# Altium schematic sheet 220V Sense Input Socket.SchDoc: 220V Sense Input Connector
size 292 x 193 mm; SheetNumber: 2; SheetTotal: 11
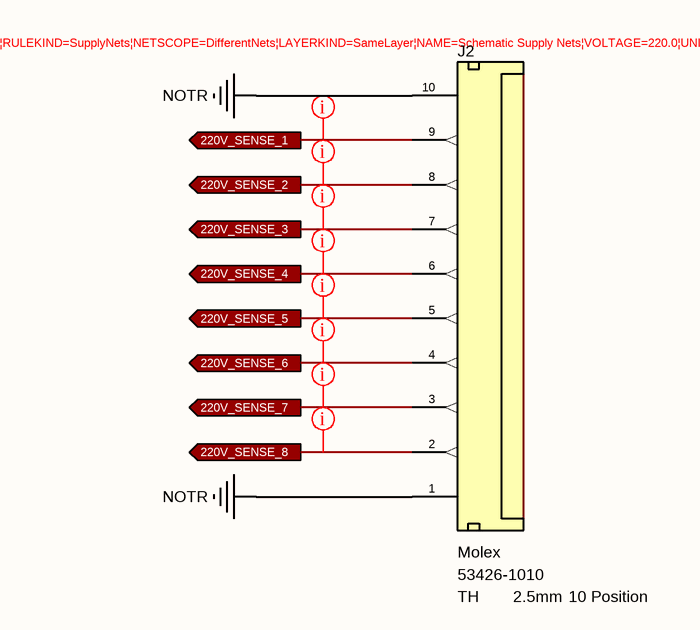
[diagram p0: 220V Sense Input Socket.SchDoc]

## Parts
J2  Manufacturer Name: Molex  Case: TH  Pitch: 2.5mm  Position: 10 Position  [Connector 10P (2.54)]  (hidden comment: 53426-1010)

## Ports
220V_SENSE_1 (out), 220V_SENSE_2 (out), 220V_SENSE_3 (out), 220V_SENSE_4 (out), 220V_SENSE_5 (out), 220V_SENSE_6 (out), 220V_SENSE_7 (out), 220V_SENSE_8 (out)

## Nets
NOTR: J2.1(Pin-1) J2.10(Pin-10)
220V_SENSE_1: J2.9(Pin-9) ; port 220V_SENSE_1
220V_SENSE_2: J2.8(Pin-8) ; port 220V_SENSE_2
220V_SENSE_3: J2.7(Pin-7) ; port 220V_SENSE_3
220V_SENSE_4: J2.6(Pin-6) ; port 220V_SENSE_4
220V_SENSE_5: J2.5(Pin-5) ; port 220V_SENSE_5
220V_SENSE_6: J2.4(Pin-4) ; port 220V_SENSE_6
220V_SENSE_7: J2.3(Pin-3) ; port 220V_SENSE_7
220V_SENSE_8: J2.2(Pin-2) ; port 220V_SENSE_8

## Layout directives
rule Supply Nets [Voltage = 220.0]; net class HV; rule Clearance Constraint [Generic clearance = 10mil, and 18 value(s) for objects]: 220V_SENSE_1, 220V_SENSE_2, 220V_SENSE_3, 220V_SENSE_4, 220V_SENSE_5, 220V_SENSE_6, 220V_SENSE_7, 220V_SENSE_8

## Notes on the sheet
- © 2021 All rights reserved.
  This document may not, in whole or in part, be copied, photocopied, reproduced, translated or converted to any electronic or machine readable from without prior written permission of Mehmet Günce Akkoyun.
  Engineer contact : akkoyun@me.com
- Property of
- Engineer :
- Date :
- Size :
- A4
- Time :
- Project :
- Page :
- /
- Customer :
- Product ID :
- Module ID :
- Version :
- File :
- Revision :

## Library data of the parts
J2 = Connector - Tunic 10P (2.5): 2.50mm Pitch Mini-Lock Wire-to-Board Header Right Angle Friction and Positive Lock 10 Circuits; System: Connector; Manufacturer Part Number: 53426-1010